# Altium schematic sheet [3]STM32F334R8T6Board_FilterAndOutputs.SchDoc
size B
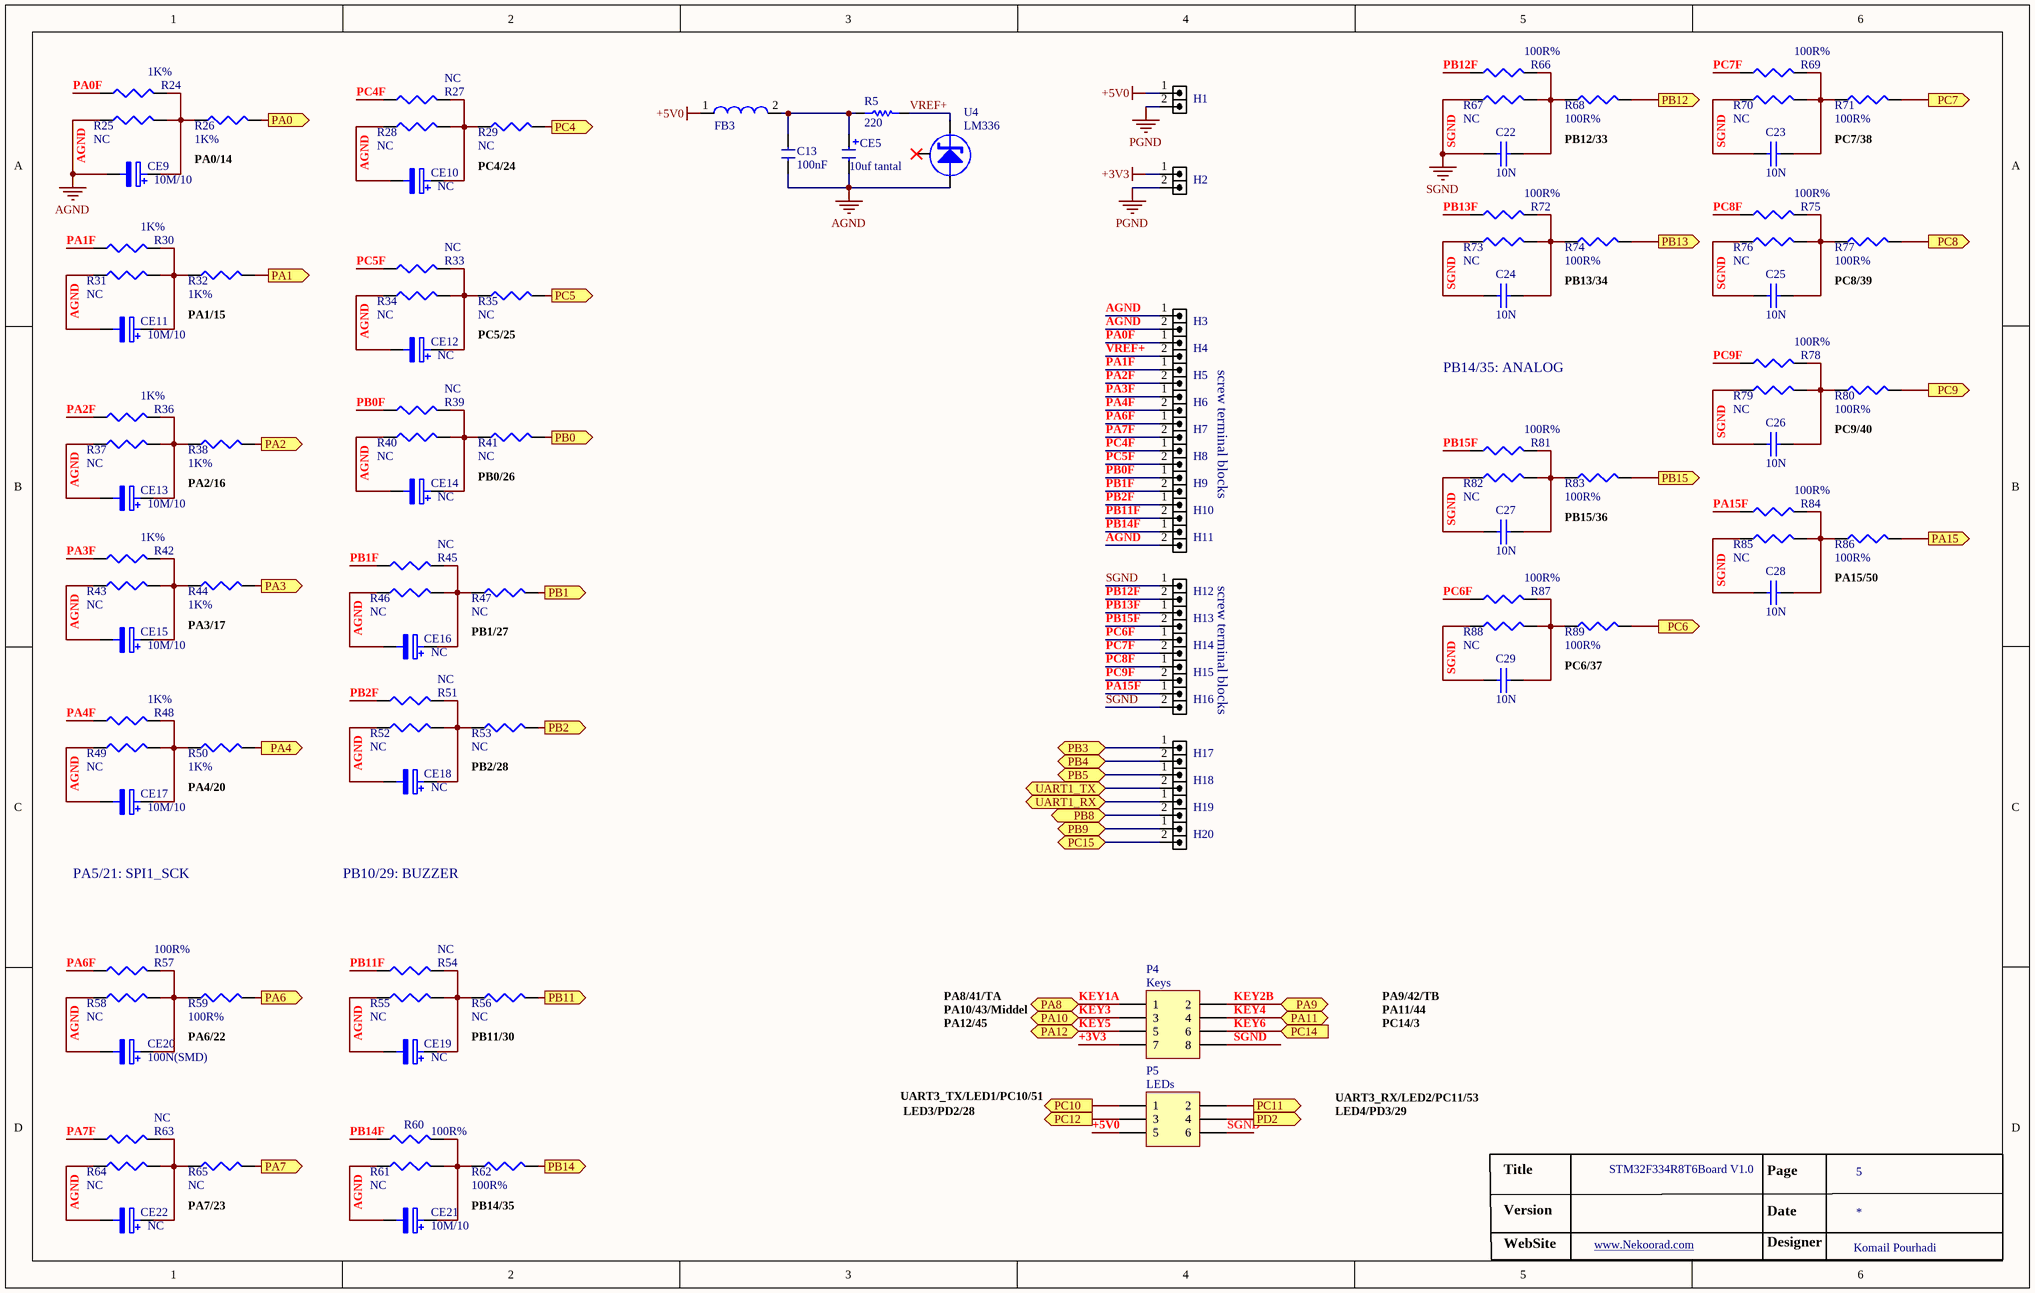
[diagram p0: [3]STM32F334R8T6Board_FilterAndOutputs.SchDoc]

## Parts
C13  Comment  [SMD_CAP_1206]  (value not drawn)
C22  10N  [SMD_CAP_1206]
C23  10N  [SMD_CAP_1206]
C24  10N  [SMD_CAP_1206]
C25  10N  [SMD_CAP_1206]
C26  10N  [SMD_CAP_1206]
C27  10N  [SMD_CAP_1206]
C28  10N  [SMD_CAP_1206]
C29  10N  [SMD_CAP_1206]
CE5  10uf tantal  [cap-e-2]
CE9  10M/10  [CAP E+1206]
CE10  NC  [CAP E+1206]
CE11  10M/10  [CAP E+1206]
CE12  NC  [CAP E+1206]
CE13  10M/10  [CAP E+1206]
CE14  NC  [CAP E+1206]
CE15  10M/10  [CAP E+1206]
CE16  NC  [CAP E+1206]
CE17  10M/10  [CAP E+1206]
CE18  NC  [CAP E+1206]
CE19  NC  [CAP E+1206]
CE20  100N(SMD)  [CAP E+1206]
CE21  10M/10  [CAP E+1206]
CE22  NC  [CAP E+1206]
FB3  Comment  [r4p]  (value not drawn)
H1  HDRM2  [header screw 2*1]  (value not drawn)
H2  HDRM2  [header screw 2*1]  (value not drawn)
H3  HDRM2  [header screw 2*1]  (value not drawn)
H4  HDRM2  [header screw 2*1]  (value not drawn)
H5  HDRM2  [header screw 2*1]  (value not drawn)
H6  HDRM2  [header screw 2*1]  (value not drawn)
H7  HDRM2  [header screw 2*1]  (value not drawn)
H8  HDRM2  [header screw 2*1]  (value not drawn)
H9  HDRM2  [header screw 2*1]  (value not drawn)
H10  HDRM2  [header screw 2*1]  (value not drawn)
H11  HDRM2  [header screw 2*1]  (value not drawn)
H12  HDRM2  [header screw 2*1]  (value not drawn)
H13  HDRM2  [header screw 2*1]  (value not drawn)
H14  HDRM2  [header screw 2*1]  (value not drawn)
H15  HDRM2  [header screw 2*1]  (value not drawn)
H16  HDRM2  [header screw 2*1]  (value not drawn)
H17  HDRM2  [header screw 2*1]  (value not drawn)
H18  HDRM2  [header screw 2*1]  (value not drawn)
H19  HDRM2  [header screw 2*1]  (value not drawn)
H20  HDRM2  [header screw 2*1]  (value not drawn)
P4  Keys  [IDC8-BOX]
P5  LEDs  [IDC6-BOX]
R5  220  [RES_1206]
R24  1K%  [RES_1206]
R25  NC  [RES_1206]
R26  1K%  [RES_1206]
R27  NC  [RES_1206]
R28  NC  [RES_1206]
R29  NC  [RES_1206]
R30  1K%  [RES_1206]
R31  NC  [RES_1206]
R32  1K%  [RES_1206]
R33  NC  [RES_1206]
R34  NC  [RES_1206]
R35  NC  [RES_1206]
R36  1K%  [RES_1206]
R37  NC  [RES_1206]
R38  1K%  [RES_1206]
R39  NC  [RES_1206]
R40  NC  [RES_1206]
R41  NC  [RES_1206]
R42  1K%  [RES_1206]
R43  NC  [RES_1206]
R44  1K%  [RES_1206]
R45  NC  [RES_1206]
R46  NC  [RES_1206]
R47  NC  [RES_1206]
R48  1K%  [RES_1206]
R49  NC  [RES_1206]
R50  1K%  [RES_1206]
R51  NC  [RES_1206]
R52  NC  [RES_1206]
R53  NC  [RES_1206]
R54  NC  [RES_1206]
R55  NC  [RES_1206]
R56  NC  [RES_1206]
R57  100R%  [RES_1206]
R58  NC  [RES_1206]
R59  100R%  [RES_1206]
R60  100R%  [RES_1206]
R61  NC  [RES_1206]
R62  100R%  [RES_1206]
R63  NC  [RES_1206]
R64  NC  [RES_1206]
R65  NC  [RES_1206]
R66  100R%  [RES_1206]
R67  NC  [RES_1206]
R68  100R%  [RES_1206]
R69  100R%  [RES_1206]
R70  NC  [RES_1206]
R71  100R%  [RES_1206]
R72  100R%  [RES_1206]
R73  NC  [RES_1206]
R74  100R%  [RES_1206]
R75  100R%  [RES_1206]
R76  NC  [RES_1206]
R77  100R%  [RES_1206]
R78  100R%  [RES_1206]
R79  NC  [RES_1206]
R80  100R%  [RES_1206]
R81  100R%  [RES_1206]
R82  NC  [RES_1206]
R83  100R%  [RES_1206]
R84  100R%  [RES_1206]
R85  NC  [RES_1206]
R86  100R%  [RES_1206]
R87  100R%  [RES_1206]
R88  NC  [RES_1206]
R89  100R%  [RES_1206]
U4  LM336  [LM336]

## Ports
PA0 (out), PA1 (out), PA2 (out), PA3 (out), PA4 (out), PA6 (out), PA7 (out), PA8 (bidir), PA9 (bidir), PA10 (bidir), PA11 (bidir), PA12 (bidir), PA15 (out), PB0 (out), PB1 (out), PB2 (out), PB3 (bidir), PB4 (bidir), PB5 (bidir), PB8 (bidir), PB9 (bidir), PB11 (out), PB12 (out), PB13 (out), PB14 (out), PB15 (out), PC4 (out), PC5 (out), PC6 (out), PC7 (out), PC8 (out), PC9 (out), PC10 (out), PC11 (out), PC12 (out), PC14 (in), PC15 (bidir), PD2 (out), UART1_RX (bidir), UART1_TX (bidir)

## Nets
+3V3: H2.1 P4.7
+5V0: FB3.1 H1.1 P5.5
AGND: C13.1 CE5.2 CE9.2 CE10.2 CE11.2 CE12.2 CE13.2 CE14.2 CE15.2 CE16.2 CE17.2 CE18.2 CE19.2 CE20.2 CE21.2 CE22.2 H3.1 H3.2 H11.2 R25.1 R28.1 R31.1 R34.1 R37.1 R40.1 R43.1 R46.1 R49.1 R52.1 R55.1 R58.1 R61.1 R64.1 U4.1
PGND: H1.2 H2.2
SGND: C22.2 C23.2 C24.2 C25.2 C26.2 C27.2 C28.2 C29.2 H12.1 H16.2 P4.8 P5.6 R67.1 R70.1 R73.1 R76.1 R79.1 R82.1 R85.1 R88.1
KEY1A: P4.1 ; port PA8
KEY2B: P4.2 ; port PA9
KEY3: P4.3 ; port PA10
KEY4: P4.4 ; port PA11
KEY5: P4.5 ; port PA12
KEY6: P4.6 ; port PC14
PA0: R26.2 ; port PA0
PA0F: H4.1 R24.1
PA1: R32.2 ; port PA1
PA1F: H5.1 R30.1
PA2: R38.2 ; port PA2
PA2F: H5.2 R36.1
PA3: R44.2 ; port PA3
PA3F: H6.1 R42.1
PA4: R50.2 ; port PA4
PA4F: H6.2 R48.1
PA6: R59.2 ; port PA6
PA6F: H7.1 R57.1
PA7: R65.2 ; port PA7
PA7F: H7.2 R63.1
PA15: R86.2 ; port PA15
PA15F: H16.1 R84.1
PB0: R41.2 ; port PB0
PB0F: H9.1 R39.1
PB1: R47.2 ; port PB1
PB1F: H9.2 R45.1
PB2: R53.2 ; port PB2
PB2F: H10.1 R51.1
PB3: H17.1 ; port PB3
PB4: H17.2 ; port PB4
PB5: H18.1 ; port PB5
PB8: H19.2 ; port PB8
PB9: H20.1 ; port PB9
PB11: R56.2 ; port PB11
PB11F: H10.2 R54.1
PB12: R68.2 ; port PB12
PB12F: H12.2 R66.1
PB13: R74.2 ; port PB13
PB13F: H13.1 R72.1
PB14: R62.2 ; port PB14
PB14F: H11.1 R60.1
PB15: R83.2 ; port PB15
PB15F: H13.2 R81.1
PC4: R29.2 ; port PC4
PC4F: H8.1 R27.1
PC5: R35.2 ; port PC5
PC5F: H8.2 R33.1
PC6: R89.2 ; port PC6
PC6F: H14.1 R87.1
PC7: R71.2 ; port PC7
PC7F: H14.2 R69.1
PC8: R77.2 ; port PC8
PC8F: H15.1 R75.1
PC9: R80.2 ; port PC9
PC9F: H15.2 R78.1
PC10: P5.1 ; port PC10
PC11: P5.2 ; port PC11
PC12: P5.3 ; port PC12
PC15: H20.2 ; port PC15
PD2: P5.4 ; port PD2
UART1_RX: H19.1 ; port UART1_RX
UART1_TX: H18.2 ; port UART1_TX
VREF+: H4.2 R5.2 U4.2
NetC13_2: C13.2 CE5.1 FB3.2 R5.1
NetC22_1: C22.1 R66.2 R67.2 R68.1
NetC23_1: C23.1 R69.2 R70.2 R71.1
NetC24_1: C24.1 R72.2 R73.2 R74.1
NetC25_1: C25.1 R75.2 R76.2 R77.1
NetC26_1: C26.1 R78.2 R79.2 R80.1
NetC27_1: C27.1 R81.2 R82.2 R83.1
NetC28_1: C28.1 R84.2 R85.2 R86.1
NetC29_1: C29.1 R87.2 R88.2 R89.1
NetCE9_1: CE9.1 R24.2 R25.2 R26.1
NetCE10_1: CE10.1 R27.2 R28.2 R29.1
NetCE11_1: CE11.1 R30.2 R31.2 R32.1
NetCE12_1: CE12.1 R33.2 R34.2 R35.1
NetCE13_1: CE13.1 R36.2 R37.2 R38.1
NetCE14_1: CE14.1 R39.2 R40.2 R41.1
NetCE15_1: CE15.1 R42.2 R43.2 R44.1
NetCE16_1: CE16.1 R45.2 R46.2 R47.1
NetCE17_1: CE17.1 R48.2 R49.2 R50.1
NetCE18_1: CE18.1 R51.2 R52.2 R53.1
NetCE19_1: CE19.1 R54.2 R55.2 R56.1
NetCE20_1: CE20.1 R57.2 R58.2 R59.1
NetCE21_1: CE21.1 R60.2 R61.2 R62.1
NetCE22_1: CE22.1 R63.2 R64.2 R65.1

Not connected (* = marked no-connect by the designer): U4 3*

## Notes on the sheet
- PA0/14
- PB12/33
- PC7/38
- PC4/24
- PB13/34
- PC8/39
- PA1/15
- PC5/25
- screw terminal blocks
- PB14/35: ANALOG
- PC9/40
- PA2/16
- PB0/26
- PB15/36
- PA3/17
- PB1/27
- PA15/50
- PC6/37
- PB2/28
- PA4/20
- PA5/21: SPI1_SCK
- PB10/29: BUZZER
- PA6/22
- PB11/30
- PA8/41/TA
- PA10/43/Middel
- PA12/45
- PA9/42/TB
- PA11/44
- PC14/3
- UART3_TX/LED1/PC10/51
- UART3_RX/LED2/PC11/53
- LED3/PD2/28
- LED4/PD3/29
- Title
- STM32F334R8T6Board V1.0
- Page
- 5
- PA7/23
- PB14/35
- Version
- WebSite
- www.Nekoorad.com <http://www.Nekoorad.com>
- Date
- Designer
- Komail Pourhadi
- (in symbol Capacitor SMD) 100nF

## Library data of the parts
C13 = Capacitor SMD
C22-C29 = C
CE5 = Capacitor Tantalium
CE9-CE22 = E
FB3 = Ferrit Bead
H1-H20 = HDR_M_1X2: CONN, HEADER, Male, pitch: 2.54mm, 2POS; VALUE: HDRM2
P4 = Header 4X2: Header, 4-Pin, Dual row; LatestRevisionDate: 17-Jul-2002; LatestRevisionNote: Re-released for DXP Platform.; Publisher: Altium Limited
P5 = Header 3X2: Header, 3-Pin, Dual row; LatestRevisionDate: 17-Jul-2002; LatestRevisionNote: Re-released for DXP Platform.; Publisher: Altium Limited
R5 = Resistor: Tolerance: 5%; Power: 1/8 W; Value: 220
R24-R89 = R